# Altium schematic sheet SCH_AT89.SchDoc
size A4; SheetNumber: 1; SheetTotal: 1
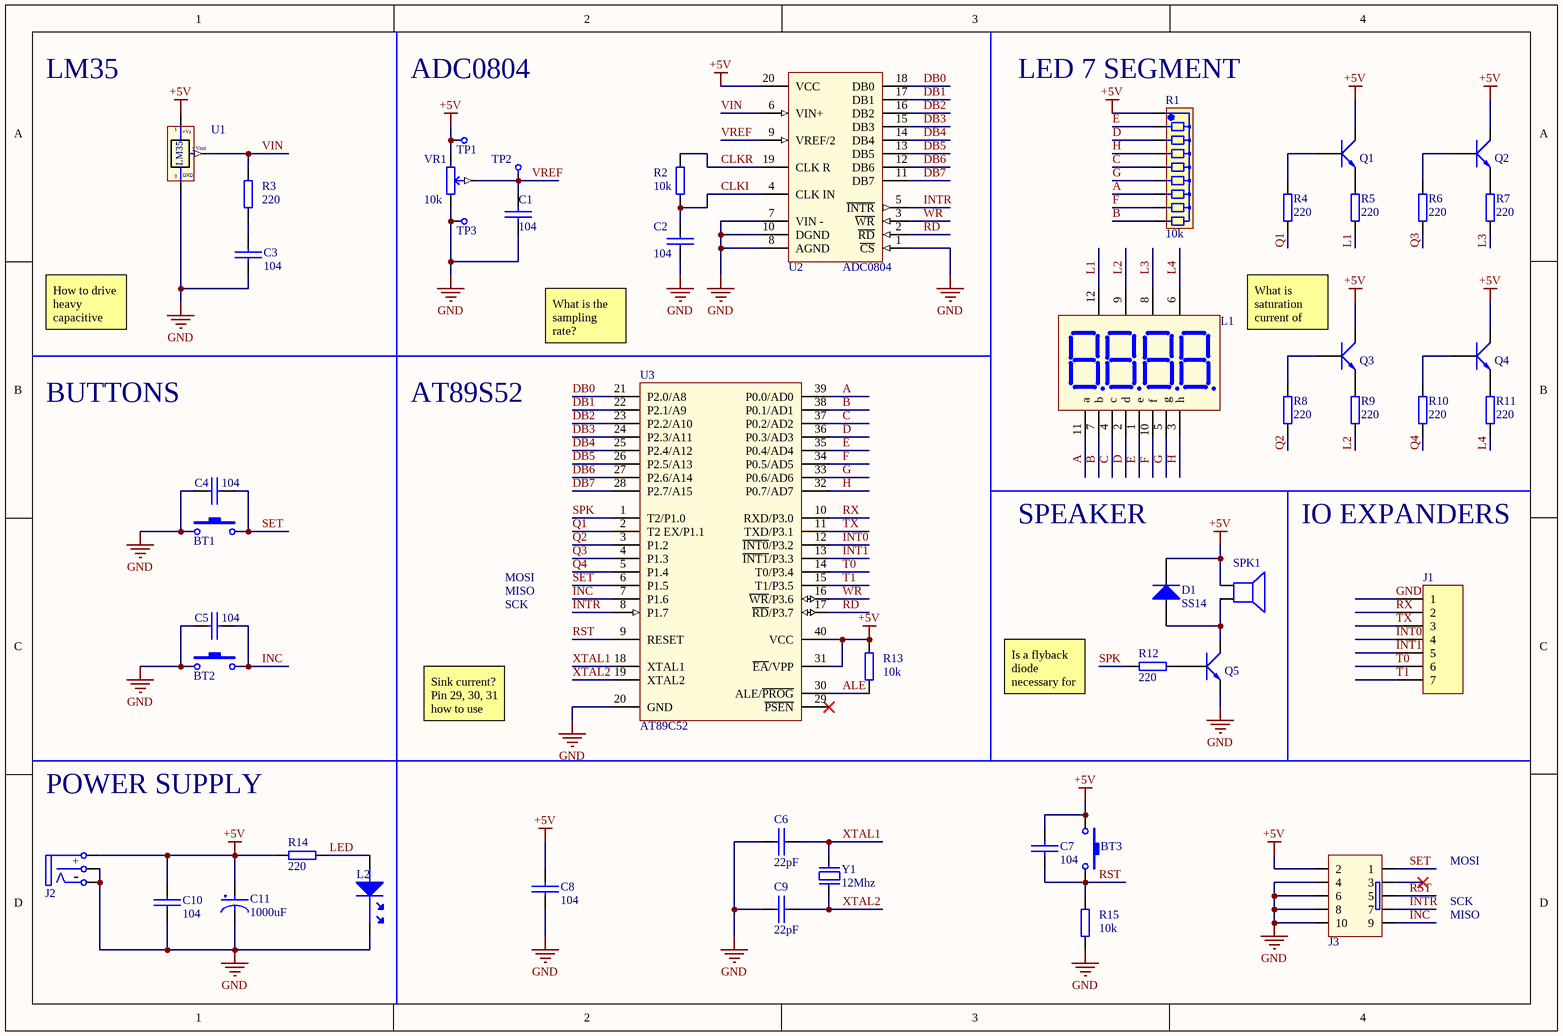
[diagram p0: SCH_AT89.SchDoc]

## Parts
BT1  Nut Nhan 2 Chan SMD 3x6x2.5  [Nut Nhan 2 Chan SMD 3x6x2.5]  (value not drawn)
BT2  Nut Nhan 2 Chan SMD 3x6x2.5  [Nut Nhan 2 Chan SMD 3x6x2.5]  (value not drawn)
BT3  Nut Nhan 2 Chan SMD 3x6x2.5  [Nut Nhan 2 Chan SMD 3x6x2.5]  (value not drawn)
C1  104  [tu 0805]
C2  104  [tu 0805]
C3  104  [tu 0805]
C4  104  [tu 0805]
C5  104  [tu 0805]
C6  22pF  [tu 0805]
C7  104  [tu 0805]
C8  104  [tu 0805]
C9  22pF  [tu 0805]
C10  104  [tu 0805]
C11  1000uF  [tu hoa 10mm]
D1  SS14  [DIODE SMA]
J1  Header 7  [HDR1X7]  (value not drawn)
J2  JACK DC 5.5  [JACK DC 5.5]  (value not drawn)
J3  IDC 5X2  [IDC10]  (value not drawn)
L1  Led 7 Segment 4 digitals  [LED7SEG-4-0.36]  (value not drawn)
L2  LED 0805  [LED-0805-Red]  (value not drawn)
Q1  HF  [SOT23]  (value not drawn)
Q2  HF  [SOT23]  (value not drawn)
Q3  HF  [SOT23]  (value not drawn)
Q4  HF  [SOT23]  (value not drawn)
Q5  HF  [SOT23]  (value not drawn)
R1  10k  [tro bang a9]
R2  10k  [tro smd 0805]
R3  220  [tro smd 0805]
R4  220  [tro smd 0805]
R5  220  [tro smd 0805]
R6  220  [tro smd 0805]
R7  220  [tro smd 0805]
R8  220  [tro smd 0805]
R9  220  [tro smd 0805]
R10  220  [tro smd 0805]
R11  220  [tro smd 0805]
R12  220  [tro smd 0805]
R13  10k  [tro smd 0805]
R14  220  [tro smd 0805]
R15  10k  [tro smd 0805]
SPK1  Speaker  [Coi Chip Speacker]  (value not drawn)
TP1  TESTPOINT  [Testpoint]  (value not drawn)  (no BOM)
TP2  TESTPOINT  [Testpoint]  (value not drawn)  (no BOM)
TP3  TESTPOINT  [Testpoint]  (value not drawn)  (no BOM)
U1  LM35  [QTO-92]  (value not drawn)
U2  ADC0804  [DIP20]
U3  AT89C52  [DIP40/W0.6]
VR1  10k  [Bien Tro Vi Chinh Dung]
Y1  12Mhz  [Thach Anh 2 chan cam]

## Nets
+5V: BT3.1 C7.1 C8.1 C10.1 C11.1 D1.2(K) J2.1(T) J3.2 Q1.3(C) Q2.3(C) Q3.3(C) Q4.3(C) R1.1 R13.2 R14.2 SPK1.1 TP1.1(TP) U1.1(+Vs) U2.20(VCC) U3.31(~{EA}/VPP) U3.40(VCC) VR1.1
GND: BT1.2 BT2.2 C1.2 C2.2 C3.2 C4.2 C5.2 C6.2 C8.2 C9.2 C10.2 C11.2 J1.1 J2.2(TN) J2.3(S) J3.4 J3.6 J3.8 J3.10 L2.1(A) Q5.2(E) R15.1 TP3.1(TP) U1.3(-) U2.1(~{CS}) U2.7(VIN_-) U2.8(AGND) U2.10(DGND) U3.20(GND) VR1.3
A: L1.11(a) R1.7 U3.39(P0.0/AD0)
ALE: R13.1 U3.30(ALE/~{PROG})
B: L1.7(b) R1.9 U3.38(P0.1/AD1)
C: L1.4(c) R1.5 U3.37(P0.2/AD2)
CLKI: C2.1 R2.1 U2.4(CLK_IN)
CLKR: R2.2 U2.19(CLK_R)
D: L1.2(d) R1.3 U3.36(P0.3/AD3)
DB0: U2.18(DB0) U3.21(P2.0/A8)
DB1: U2.17(DB1) U3.22(P2.1/A9)
DB2: U2.16(DB2) U3.23(P2.2/A10)
DB3: U2.15(DB3) U3.24(P2.3/A11)
DB4: U2.14(DB4) U3.25(P2.4/A12)
DB5: U2.13(DB5) U3.26(P2.5/A13)
DB6: U2.12(DB6) U3.27(P2.6/A14)
DB7: U2.11(DB7) U3.28(P2.7/A15)
E: L1.1(e) R1.2 U3.35(P0.4/AD4)
F: L1.10(f) R1.8 U3.34(P0.5/AD5)
G: L1.5(g) R1.6 U3.33(P0.6/AD6)
H: L1.3(h) R1.4 U3.32(P0.7/AD7)
INC: BT2.1 C5.1 J3.9 U3.7(P1.6)
INT0: J1.4 U3.12(~{INT0}/P3.2)
INT1: J1.5 U3.13(~{INT1}/P3.3)
INTR: J3.7 U2.5(~{INTR}) U3.8(P1.7)
L1: L1.12(V1) R5.2
L2: L1.9(V2) R9.2
L3: L1.8(V3) R7.2
L4: L1.6(V4) R11.2
LED: L2.2(K) R14.1
Q1: R4.2 U3.2(T2_EX/P1.1)
Q2: R8.2 U3.3(P1.2)
Q3: R6.2 U3.4(P1.3)
Q4: R10.2 U3.5(P1.4)
RD: U2.2(~{RD}) U3.17(~{RD}/P3.7)
RST: BT3.2 C7.2 J3.5 R15.2 U3.9(RESET)
RX: J1.2 U3.10(RXD/P3.0)
SET: BT1.1 C4.1 J3.1 U3.6(P1.5)
SPK: R12.2 U3.1(T2/P1.0)
T0: J1.6 U3.14(T0/P3.4)
T1: J1.7 U3.15(T1/P3.5)
TX: J1.3 U3.11(TXD/P3.1)
VIN: R3.2 U1.2(Vout) U2.6(VIN+)
VREF: C1.1 TP2.1(TP) U2.9(VREF/2) VR1.2
WR: U2.3(~{WR}) U3.16(~{WR}/P3.6)
XTAL1: C6.1 U3.18(XTAL1) Y1.2
XTAL2: C9.1 U3.19(XTAL2) Y1.1
NetC3_1: C3.1 R3.1
NetD1_1: D1.1(A) Q5.3(C) SPK1.2
NetQ1_1: Q1.1(B) R4.1
NetQ1_2: Q1.2(E) R5.1
NetQ2_1: Q2.1(B) R6.1
NetQ2_2: Q2.2(E) R7.1
NetQ3_1: Q3.1(B) R8.1
NetQ3_2: Q3.2(E) R9.1
NetQ4_1: Q4.1(B) R10.1
NetQ4_2: Q4.2(E) R11.1
NetQ5_1: Q5.1(B) R12.1

Not connected (* = marked no-connect by the designer): J3 3*; U3 29(~{PSEN})*

## Notes on the sheet
- LM35
- ADC0804
- (near R1) LED 7 SEGMENT
- How to drive heavy capacitive load?
- What is the sampling rate?
  RC oscillator?
- (near Q3) What is saturation current of C1815 transistor?
- BUTTONS
- AT89S52
- MOSI
- SPEAKER
- IO EXPANDERS
- MISO
- SCK
- Sink current?
  Pin 29, 30, 31 how to use these?
- Is a flyback diode necessary for a speaker?
- POWER SUPPLY
- (in symbol JACK DC 5.5) +; -
- (in symbol LM35) GND

## Library data of the parts
BT1-BT3 = Nut Nhan 2 Chan SMD 3x6x2.5: Ma_Hang: MH001036; Ten: Nút Nhấn 2 Chân 3x6x2.5MM SMD
C1-C10 = CAP0805: SMD; Chung_Loai: Dán; Don_Vi: Con; So_Chan: 2; Ten_Linh_Kien: Tụ 0805 104-100nF 10% 50V; Ma_Hang: MH004551; Kieu_Chan: *
C11 = CAPElectrolytic: THT; Chung_Loai: Cắm; So_Chan: 2; Don_Vi: Con; Ten_Linh_Kien: Tụ Hóa 1000uF 10V 10x12MM; Ma_Hang: MH006614; Kieu_Chan: *
D1 = Diode SS14 ( 1N5819): Dán; Ma_Hang: MH002211; Don_Vi: Con; Ten_Linh_Kien: Diode SS14 DO214 Schottky 1A 40V ( 1N5819 DO214); Chung_Loai: Dán; Ghi_Chu: *; Kieu_Chan: *
J1 = Header 7: Header, 7-Pin; LatestRevisionDate: 17-Jul-2002; LatestRevisionNote: Re-released for DXP Platform.; Publisher: Altium Limited
J2 = JACK DC 5.5: THT; Value: Jac DC
J3 = ICSP 5x2: THT; Value: Header 5x2
L1 = LED7SEG-A-0.36-4DIGIT: 4 digit 7 segment anot; Solder: WAVE; Category: LED
L2 = LED0805: SMD; Don_Vi: Con; Chung_Loai: Dán; Ma_Hang: MH000897; Ten_Linh_Kien: LED 0805 Màu Đỏ (Red); Ghi_Chu: *; Kieu_Chan: *
Q1-Q5 = C1815 HF SMD: NPN transistor; Value: C9014
R1 = Tro Bang A9 10k: Cắm; Don_Vi: Con; So_Chan: 9; Ten_Linh_Kien: Trở Băng A09-103 10k 1/8w 5%; Ma_Hang: MH001442; Chung_Loai: Cắm; Kieu_Chan: *
R2-R15 = RES0805: SMD; Chung_Loai: Dán; Don_Vi: Con; So_Chan: 2; Ten_Linh_Kien: Trở 0805 1% 10k; Ma_Hang: MH005473; Kieu_Chan: *
SPK1 = Coi Chip Speaker: Còi chip
TP1-TP3 = TESTPOINT: SMD
U1 = LM35: THT; Value: LM35
U2 = ADC0804: THT; Ten_Linh_Kien: ADC0804LCN DIP20; Don_Vi: Con; Ma_Hang: MH002626; Chung_Loai: Cắm; Ghi_Chu: *; Kieu_Chan: *
U3 = AT89C52: THT; Ten_Linh_Kien: AT89C52-24PC DIP40; Don_Vi: Con; Ma_Hang: MH002200; Chung_Loai: Cắm; Ghi_Chu: *; Kieu _Chan: *
VR1 = RESVariable: THT; Ma_Hang: MH003232; Ten_Linh_Kien: Biến Trở VR 103-10K 3296W; Chung_Loai: Cắm; Don_Vi: Con; Kieu_Chan: *; Ghi_Chu: *
Y1 = Thach Anh 2 chan Cam: Crystal For all Crystal 2pin.; Value: 4Mhz